# EAGLE schematic mega_shield_0_2 (EAGLE 6.5.0)
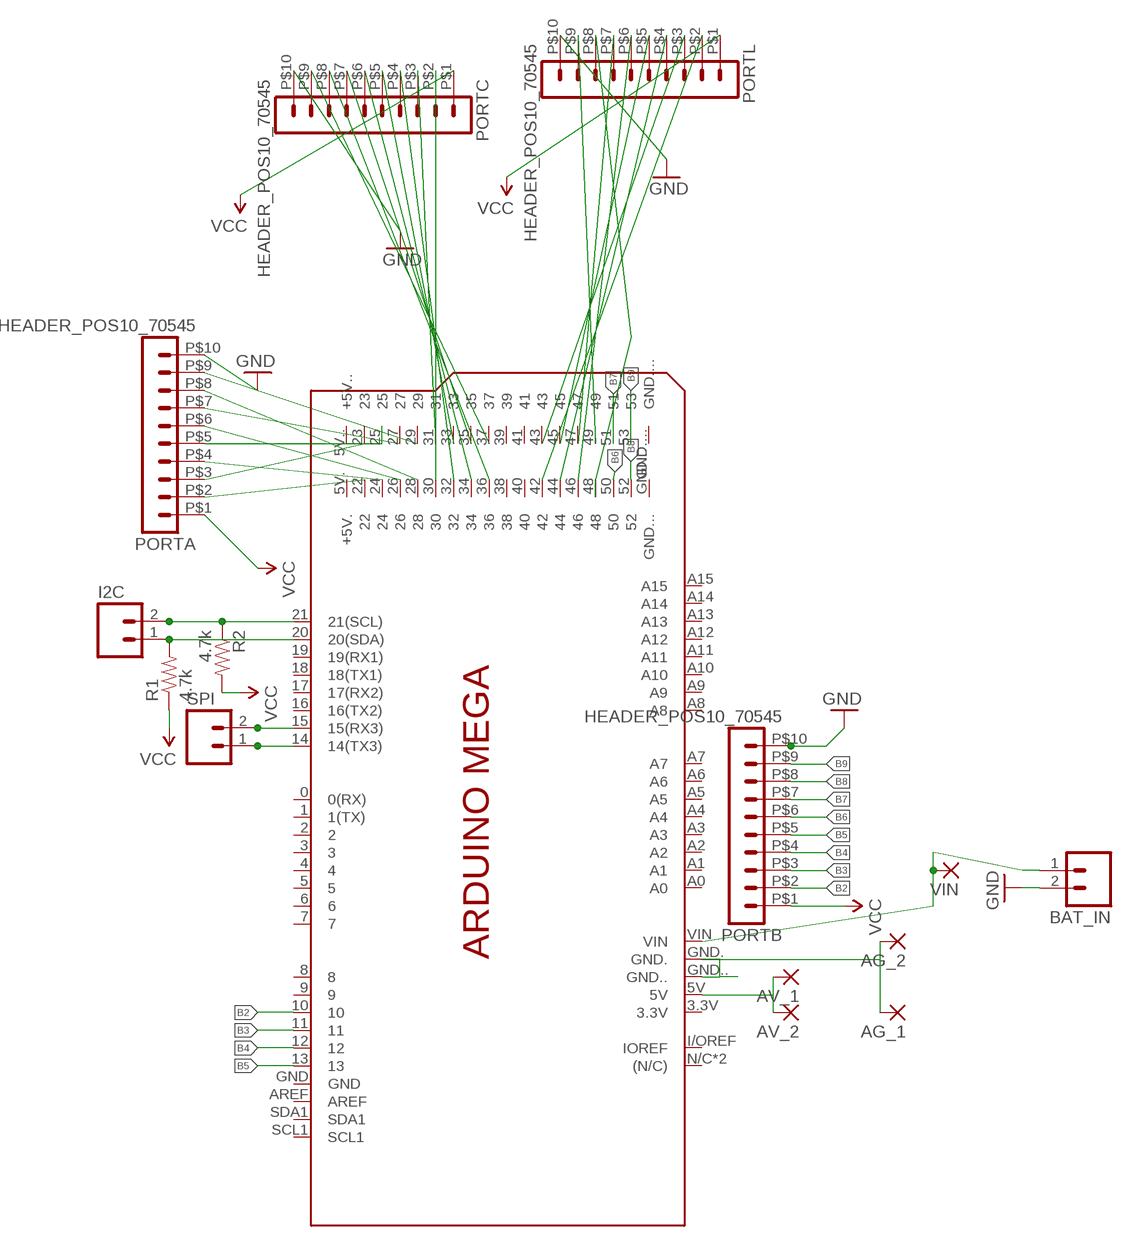
[diagram p0: schematic, sheet 1]

## Parts
AG_1  2,54/1,0  [2,54/1,0]
AG_2  2,54/1,0  [2,54/1,0]
AV_1  2,54/1,0  [2,54/1,0]
AV_2  2,54/1,0  [2,54/1,0]
BAT_IN  M02PTH  [1X02]
I2C  M02PTH  [1X02]
PCB1  ARDUINO_MEGA  [ARDUINO_MEGA]
PORTA  HEADER_POS10_70545  [70545-POS10]
PORTB  HEADER_POS10_70545  [70545-POS10]
PORTC  HEADER_POS10_70545  [70545-POS10]
PORTL  HEADER_POS10_70545  [70545-POS10]
R1  4.7k  RESISTORPTH1  [AXIAL-0.3]
R2  4.7k  RESISTORPTH1  [AXIAL-0.3]
SPI  M02PTH  [1X02]
VIN  2,54/1,0  [2,54/1,0]

## Nets
B2: PCB1.10 PORTB.P$2
B3: PCB1.11 PORTB.P$3
B4: PCB1.12 PORTB.P$4
B5: PCB1.13 PORTB.P$5
B6: PCB1.50 PORTB.P$6
B7: PCB1.51 PORTB.P$7
B8: PCB1.52 PORTB.P$8
B9: PCB1.53 PORTB.P$9
GND: BAT_IN.2 PORTA.P$10 PORTB.P$10 PORTC.P$10 PORTL.P$10
GND_PI: AG_1.1(P) AG_2.1(P) PCB1.GND. PCB1.GND..
N$1: PCB1.22 PORTA.P$2
N$2: PCB1.23 PORTA.P$3
N$3: PCB1.24 PORTA.P$4
N$4: PCB1.25 PORTA.P$5
N$5: PCB1.26 PORTA.P$6
N$6: PCB1.27 PORTA.P$7
N$7: PCB1.28 PORTA.P$8
N$8: PCB1.29 PORTA.P$9
N$9: PCB1.14(14(TX3)) SPI.1
N$10: PCB1.15(15(RX3)) SPI.2
N$11: PCB1.30 PORTC.P$2
N$12: PCB1.31 PORTC.P$3
N$13: PCB1.32 PORTC.P$4
N$14: PCB1.33 PORTC.P$5
N$15: PCB1.34 PORTC.P$6
N$16: PCB1.35 PORTC.P$7
N$17: PCB1.36 PORTC.P$8
N$18: PCB1.37 PORTC.P$9
N$19: PCB1.42 PORTL.P$2
N$20: PCB1.43 PORTL.P$3
N$21: PCB1.44 PORTL.P$4
N$22: PCB1.45 PORTL.P$5
N$23: PCB1.46 PORTL.P$6
N$24: PCB1.47 PORTL.P$7
N$25: PCB1.49 PORTL.P$9
N$29: PCB1.48 PORTL.P$8
N$35: I2C.1 PCB1.20(20(SDA)) R1.P$2
N$36: I2C.2 PCB1.21(21(SCL)) R2.P$1
PI_VCC: AV_1.1(P) AV_2.1(P) PCB1.5V
VCC: PORTA.P$1 PORTB.P$1 PORTC.P$1 PORTL.P$1 R1.P$1 R2.P$2
VIN: BAT_IN.1 PCB1.VIN VIN.1(P)
Unconnected: PCB1.0(0(RX)) PCB1.1(1(TX)) PCB1.2 PCB1.3 PCB1.3.3V PCB1.4 PCB1.5 PCB1.5V.(+5V.) PCB1.5V..(+5V..) PCB1.6 PCB1.7 PCB1.8 PCB1.9 PCB1.16(16(TX2)) PCB1.17(17(RX2)) PCB1.18(18(TX1)) PCB1.19(19(RX1)) PCB1.38 PCB1.39 PCB1.40 PCB1.41 PCB1.A0 PCB1.A1 PCB1.A2 PCB1.A3 PCB1.A4 PCB1.A5 PCB1.A6 PCB1.A7 PCB1.A8 PCB1.A9 PCB1.A10 PCB1.A11 PCB1.A12 PCB1.A13 PCB1.A14 PCB1.A15 PCB1.AREF PCB1.GND PCB1.GND... PCB1.GND.... PCB1.I/OREF(IOREF) PCB1.N/C((N/C)) PCB1.RESET((N/C)) PCB1.SCL1 PCB1.SDA1

## Library data of the parts
AG_1 AG_2 AV_1 AV_2 VIN = wirepad:2,54/1,0: THROUGH-HOLE PAD
BAT_IN I2C SPI = SparkFun:M02: Header 2 Standard 2-pin 0.1" header. Use with straight break away headers (SKU : PRT-00116), right angle break away headers (PRT-00553), swiss pins (PRT-00743), machine pins (PRT-00117), and female headers (PRT-00115). Molex polarized connector foot print use with SKU : PRT-08233 with associated crimp pins and housings.
PCB1 = Nathans_Arduinos:ARDUINO_MEGA: Device for representing an Arduino Mega board with a footprint in an EAGLE design. Created by Dave Young for Element14. More EAGLE documentation at: http://www.element14.com/community/community/knode/cadsoft_eagle
PORTA PORTB PORTC PORTL = con-molex-c-grid-sl:HEADER_POS10_?: Molex -C-Grid® / SL Series connector Wire-to-Board 2.54 mm (0.100") pitch header, 10 positions.
R1 R2 = SparkFun:RESISTOR: Resistor Basic schematic elements and footprints for 0603, 1206, and PTH 1/10th watt (small) resistors.

## Net classes
0 default: width 0.203 mm, drill 0.254 mm, clearance 0.178 mm
1 VCC: width 0.381 mm, drill 0.305 mm, clearance 0.305 mm